# EAGLE schematic SolenoidTestWiring (EAGLE 7.6.0)
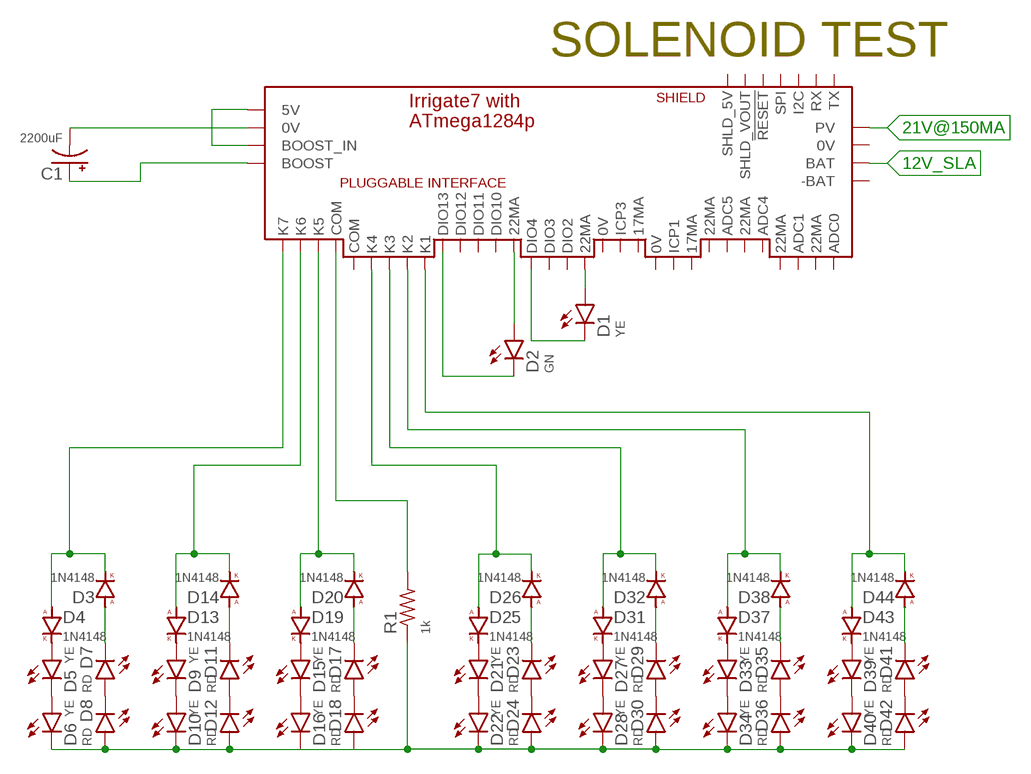
[diagram p0: schematic, sheet 1]

## Parts
C1  2200uF  C-AL7.5X18  [E7,5-18]
D1  YE  LED5MM  [LED5MM]
D2  GN  LED5MM  [LED5MM]
D3  1N4148  DDO41-10  [DO41.4]
D4  1N4148  DDO41-10  [DO41.4]
D5  RD  LED5MM  [LED5MM]
D6  RD  LED5MM  [LED5MM]
D7  YE  LED5MM  [LED5MM]
D8  YE  LED5MM  [LED5MM]
D9  RD  LED5MM  [LED5MM]
D10  RD  LED5MM  [LED5MM]
D11  YE  LED5MM  [LED5MM]
D12  YE  LED5MM  [LED5MM]
D13  1N4148  DDO41-10  [DO41.4]
D14  1N4148  DDO41-10  [DO41.4]
D15  RD  LED5MM  [LED5MM]
D16  RD  LED5MM  [LED5MM]
D17  YE  LED5MM  [LED5MM]
D18  YE  LED5MM  [LED5MM]
D19  1N4148  DDO41-10  [DO41.4]
D20  1N4148  DDO41-10  [DO41.4]
D21  RD  LED5MM  [LED5MM]
D22  RD  LED5MM  [LED5MM]
D23  YE  LED5MM  [LED5MM]
D24  YE  LED5MM  [LED5MM]
D25  1N4148  DDO41-10  [DO41.4]
D26  1N4148  DDO41-10  [DO41.4]
D27  RD  LED5MM  [LED5MM]
D28  RD  LED5MM  [LED5MM]
D29  YE  LED5MM  [LED5MM]
D30  YE  LED5MM  [LED5MM]
D31  1N4148  DDO41-10  [DO41.4]
D32  1N4148  DDO41-10  [DO41.4]
D33  RD  LED5MM  [LED5MM]
D34  RD  LED5MM  [LED5MM]
D35  YE  LED5MM  [LED5MM]
D36  YE  LED5MM  [LED5MM]
D37  1N4148  DDO41-10  [DO41.4]
D38  1N4148  DDO41-10  [DO41.4]
D39  RD  LED5MM  [LED5MM]
D40  RD  LED5MM  [LED5MM]
D41  YE  LED5MM  [LED5MM]
D42  YE  LED5MM  [LED5MM]
D43  1N4148  DDO41-10  [DO41.4]
D44  1N4148  DDO41-10  [DO41.4]
R1  1k  R0805  [C0805(2012)]
U$1  IRRIGATE7  [WITH_RPU_NAMES]

## Nets
12V_SLA: U$1.BAT
21V@150MA: U$1.PV
N$1: U$1.5V U$1.BOOST_IN
N$2: C1.+ U$1.BOOST
N$3: D1.A U$1.22MA@DIO2(22MA)
N$4: C1.- U$1.0V
N$5: D1.K U$1.DIO4
N$6: D2.A U$1.22MA@DIO10(22MA)
N$7: D2.K U$1.DIO13
N$8: D5.K D6.A
N$9: D4.C(K) D5.A
N$10: D11.A D12.K
N$11: D3.A D7.K
N$12: D3.C(K) D4.A U$1.K7
N$13: D9.K D10.A
N$15: R1.2 U$1.COM@K5(COM)
N$16: D9.A D13.C(K)
N$17: D11.K D14.A
N$18: D7.A D8.K
N$19: D13.A D14.C(K) U$1.K6
N$20: D17.A D18.K
N$21: D15.K D16.A
N$22: D15.A D19.C(K)
N$23: D17.K D20.A
N$24: D19.A D20.C(K) U$1.K5
N$25: D23.A D24.K
N$26: D21.K D22.A
N$27: D21.A D25.C(K)
N$28: D23.K D26.A
N$29: D25.A D26.C(K) U$1.K4
N$30: D29.A D30.K
N$31: D27.K D28.A
N$32: D27.A D31.C(K)
N$33: D29.K D32.A
N$34: D31.A D32.C(K) U$1.K3
N$35: D35.A D36.K
N$36: D33.K D34.A
N$37: D33.A D37.C(K)
N$38: D35.K D38.A
N$39: D37.A D38.C(K) U$1.K2
N$40: D41.A D42.K
N$41: D39.K D40.A
N$42: D39.A D43.C(K)
N$43: D41.K D44.A
N$44: D43.A D44.C(K) U$1.K1
N$49: D6.K D8.A D10.K D12.A D22.K D24.A D28.K D30.A D34.K D36.A D40.K D42.A R1.1
Unconnected: D16.K D18.A U$1.0V@ICP1(0V) U$1.0V@ICP3(0V) U$1.0V@PV(0V) U$1.17MA@ICP1(17MA) U$1.17MA@ICP3(17MA) U$1.22MA@ADC0(22MA) U$1.22MA@ADC1(22MA) U$1.22MA@ADC4(22MA) U$1.22MA@ADC5(22MA) U$1.!RESET U$1.-BAT U$1.ADC0 U$1.ADC1 U$1.ADC4 U$1.ADC5 U$1.COM@K4(COM) U$1.DIO2 U$1.DIO3 U$1.DIO10 U$1.DIO11 U$1.DIO12 U$1.I2C U$1.ICP1 U$1.ICP3 U$1.RX U$1.SHLD_5V U$1.SHLD_VOUT U$1.SPI U$1.TX

## Notes on the sheet
- SOLENOID TEST

## Library data of the parts
C1 = C-Al:C-AL: Aluminum Electrolytic Capacitors PW1J222 [NICHICON,UPW1J222MHD] CAP ALUM 63V 2200UF 20% RADIAL
D1 D2 D5-D12 D15-D18 D21-D24 D27-D30 D33-D36 D39-D42 = D-LED:LED: LED 120120WH [CREE,XHGAWT-00-0000-00000HXE1] LED WHITE 6500K 150LUM-W120120
D3 D4 D13 D14 D19 D20 D25 D26 D31 D32 D37 D38 D43 D44 = D-GP:D: DIODE
R1 = R-C:R: Resiistor American-style symbol
U$1 = Documentation:IRRIGATE7: BM /w 1284p